# Altium schematic sheet External.SchDoc
size A
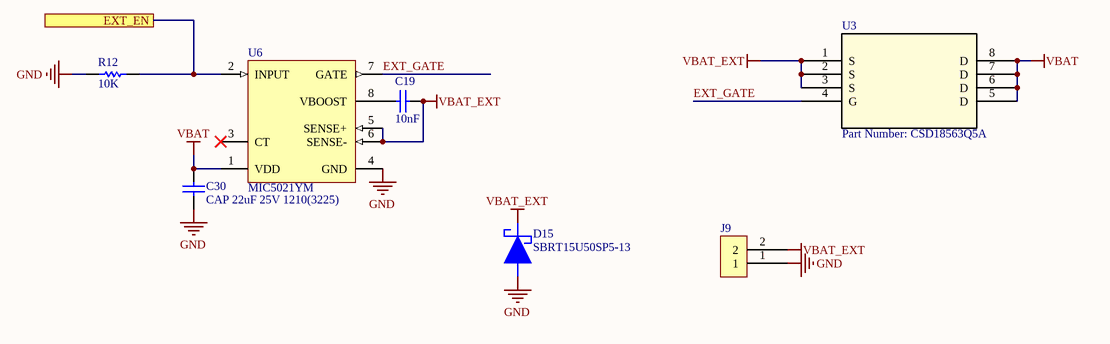
[diagram p0: External.SchDoc]

## Parts
C19  10nF  [CAPC0603(1608)100_L]
C30  CAP 22uF 25V 1210(3225)  [CAPC1210(3225)220_L]
D15  SBRT15U50SP5-13  [SBRT15U50SP5-13]
J9  (no value)  [2-pin Megafit RA]
R12  10K  [RESC0603(1608)_N]
U3  Part Number: CSD18563Q5A  [DQJ8]
U6  MIC5021YM  [MICL-SOICN-8LD-PL-1_V]

## Ports
EXT_EN

## Nets
GND: C30.1 D15.1 J9.1 R12.2 U6.4(GND)
VBAT: C30.2 U3.5(D) U3.6(D) U3.7(D) U3.8(D) U6.1(VDD)
VBAT_EXT: C19.2 D15.2 J9.2 U3.1(S) U3.2(S) U3.3(S) U6.5(SENSE+) U6.6(SENSE-)
EXT_EN: R12.1 U6.2(INPUT) ; port EXT_EN
EXT_GATE: U3.4(G) U6.7(GATE)
NetC19_1: C19.1 U6.8(VBOOST)

Not connected (* = marked no-connect by the designer): U6 3(CT)*

## Library data of the parts
C19 = CMP-1035-02315-1: CAP 10nF 25V ±2% 0603 (1608 Metric) Thickness 1mm SMD; Tolerance: Â±2%; Case-Metric: 1608; Case-EIA: 0603; Rated Voltage: 25 V; Technology: SMT; Max Thickness: 1 mm; Value: 10nF
C30 = CMP-1038-02286-1: CAP 22uF 25V -20% to +80% 1210 (3225 Metric) Thickness 2.2mm SMD; Case-Metric: 3225; Case-EIA: 1210; Rated Voltage: 25 V; Technology: SMT; Max Thickness: 2.2 mm; Value: 22uF; Tolerance: -20% to +80%
D15 = SBRT15U50SP5-13: Manufacturer: Diodes Incorporated; Diode Type: Super Barrier; Current - Average Rectified (Io): 15A; Speed: Fast Recovery =< 500ns, > 200mA (Io); Supplier 1: Digi-Key; Supplier Part Number 1: SBRT15U50SP5-13DICT-ND; Manufacturer Part Number: SBRT15U50SP5-13; RoHS: RoHS Compliant; Category: Discrete Semiconductor Products; Stock 1: 12134; Pricing 1: 1=0.93, 10=0.823, 100=0.6306, 500=0.49852, 1000=0.39882 (USD); Packaging: Cut Tape (CT); Part Status: Active; Capacitance @ Vr, F: -; Mounting Type: Surface Mount; Package / Case: PowerDI™ 5; Supplier Device Package: PowerDI®5; Operating Temperature - Junction: -65°C ~ 150°C; ComponentLink1URL: https://media.digikey.com/pdf/Data%20Sheets/Diodes%20PDFs/SBRT15U50SP5.pdf; ComponentLink1Description: https://media.digikey.com/pdf/Data%20Sheets/Diodes%20PDFs/SBRT15U50SP5.pdf
J9 = 2-pin megafit
R12 = CMP-1012-00098-1: 10K 0.1W 5% 0603 (1608 Metric)  SMD; Case-EIA: 0603; Value: 10000.00 Ohm; Case-Metric: 1608; Technology: SMT; Tolerance: 5 %; Power: 0.1 W
U3 = CSD18563Q5A: No Description Available; Vendor: Texas Instruments; Built_By: EMA_UL_Team; Manufacturer_Part_Number: CSD18563Q5A; Copyright: Copyright (C) 2018 Accelerated Designs. All rights reserved; RefDes: RefDes; Type: DEV; Value: Value
U6 = CMP-1558-00003-1: High-Speed High-Side MOSFET Driver, 12 to 36 V, -40 to 85 degC, 8-Pin SOIC, RoHS, Tube; VDD Min: 12 V; VDD Max: 36 V; ComponentLink2Description: Datasheet; Temperature Max: 85 degC; PackageDescription: 8-Pin Small Outline Integrated Package, Body 4.89 x 3.90 mm, Pitch 1.27 mm; ComponentLink1Description: Manufacturer URL; RoHS: TRUE; Temperature Min: -40 degC; ComponentLink2URL: http://www.micrel.com/_PDF/mic5021.pdf; PackageVersion: Rev. A; ComponentLink3Description: Package Specification; PartNumber: MIC5021YM; ComponentLink3URL: http://www.micrel.com/_Packages/SOICN-8LD-PL-1.pdf; Packing: Tube; Mounting Technology: Surface Mount; ComponentLink1URL: http://www.micrel.com/